# Altium schematic sheet JUMP_PI.schdoc: AT long bus (13.3 x 4.2 inches)
size A; Organization: Organization; Address1: Address1; Address2: Address2; Address3: Address3; Address4: Address4; DocumentNumber: 1; Revision: 0; SheetNumber: 2; SheetTotal: 2
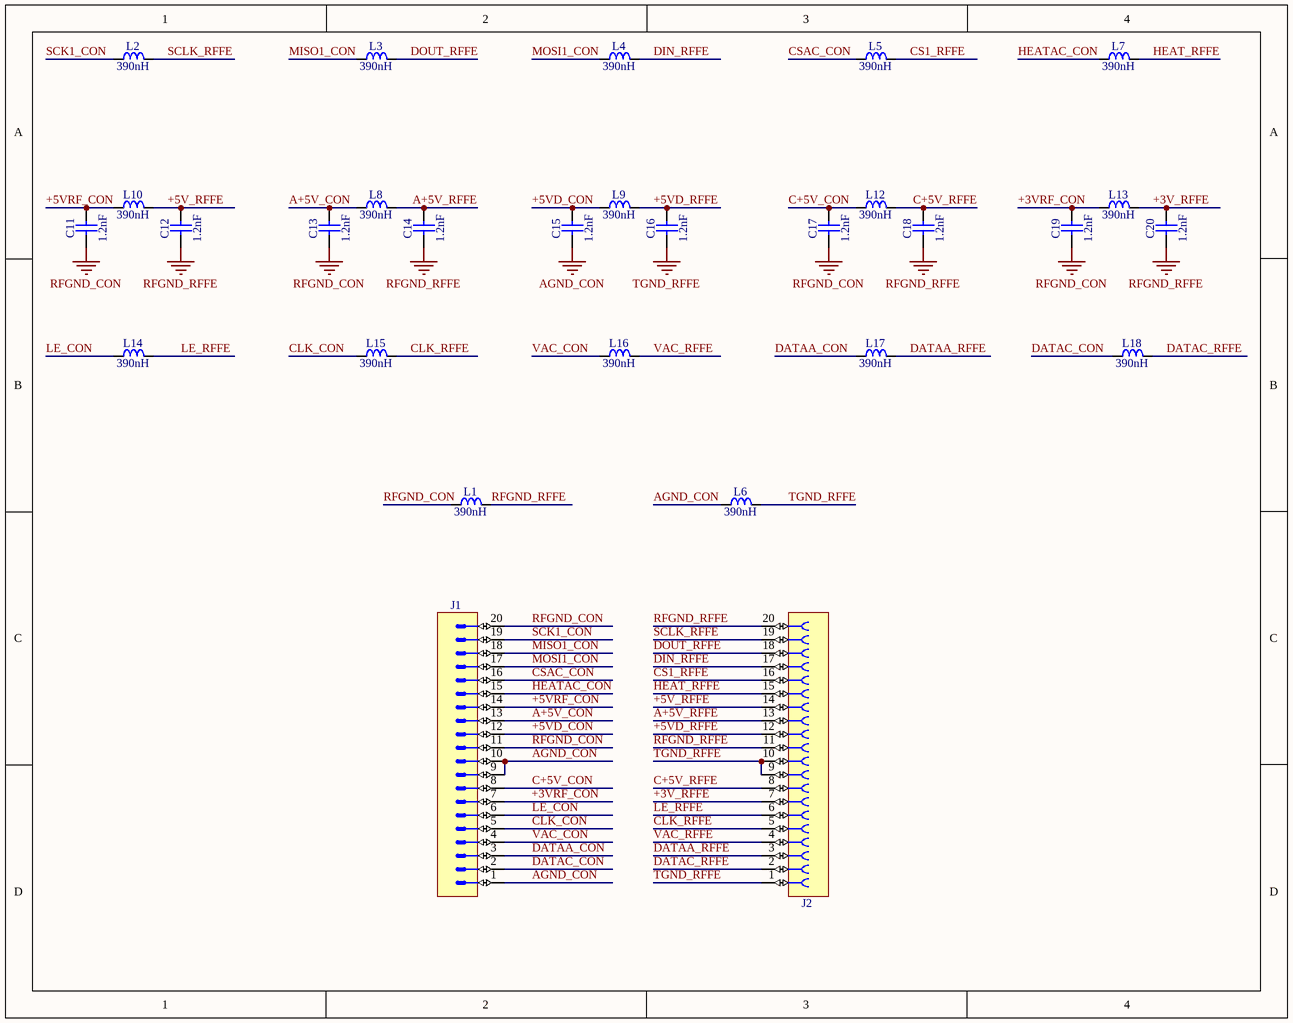
[diagram p0: JUMP_PI.schdoc]

## Parts
C11  1.2nF  [CAPC2012X135N]
C12  1.2nF  [CAPC2012X135N]
C13  1.2nF  [CAPC2012X135N]
C14  1.2nF  [CAPC2012X135N]
C15  1.2nF  [CAPC2012X135N]
C16  1.2nF  [CAPC2012X135N]
C17  1.2nF  [CAPC2012X135N]
C18  1.2nF  [CAPC2012X135N]
C19  1.2nF  [CAPC2012X135N]
C20  1.2nF  [CAPC2012X135N]
J1  Header 20  [SAMTEC_TFM-120-01-L-S-RA]  (value not drawn)
J2  Header 20  [SAMTEC_SFM-120-02-S-SH]  (value not drawn)
L1  390nH  [IND_ABRACON_AISC-0603]
L2  390nH  [IND_ABRACON_AISC-0603]
L3  390nH  [IND_ABRACON_AISC-0603]
L4  390nH  [IND_ABRACON_AISC-0603]
L5  390nH  [IND_ABRACON_AISC-0603]
L6  390nH  [IND_ABRACON_AISC-0603]
L7  390nH  [IND_ABRACON_AISC-0603]
L8  390nH  [IND_ABRACON_AISC-0603]
L9  390nH  [IND_ABRACON_AISC-0603]
L10  390nH  [IND_ABRACON_AISC-0603]
L12  390nH  [IND_ABRACON_AISC-0603]
L13  390nH  [IND_ABRACON_AISC-0603]
L14  390nH  [IND_ABRACON_AISC-0603]
L15  390nH  [IND_ABRACON_AISC-0603]
L16  390nH  [IND_ABRACON_AISC-0603]
L17  390nH  [IND_ABRACON_AISC-0603]
L18  390nH  [IND_ABRACON_AISC-0603]

## Nets
AGND_CON: C15.1 J1.1 J1.9 J1.10 L6.1
RFGND_CON: C11.1 C13.1 C17.1 C19.1 J1.11 J1.20 L1.1
RFGND_RFFE: C12.1 C14.1 C18.1 C20.1 J2.11 J2.20 L1.2
TGND_RFFE: C16.1 J2.1 J2.9 J2.10 L6.2
+3V_RFFE: C20.2 J2.7 L13.2
+3VRF_CON: C19.2 J1.7 L13.1
+5V_RFFE: C12.2 J2.14 L10.2
+5VD_CON: C15.2 J1.12 L9.1
+5VD_RFFE: C16.2 J2.12 L9.2
+5VRF_CON: C11.2 J1.14 L10.1
A+5V_CON: C13.2 J1.13 L8.1
A+5V_RFFE: C14.2 J2.13 L8.2
C+5V_CON: C17.2 J1.8 L12.1
C+5V_RFFE: C18.2 J2.8 L12.2
CLK_CON: J1.5 L15.1
CLK_RFFE: J2.5 L15.2
CS1_RFFE: J2.16 L5.2
CSAC_CON: J1.16 L5.1
DATAA_CON: J1.3 L17.1
DATAA_RFFE: J2.3 L17.2
DATAC_CON: J1.2 L18.1
DATAC_RFFE: J2.2 L18.2
DIN_RFFE: J2.17 L4.2
DOUT_RFFE: J2.18 L3.2
HEAT_RFFE: J2.15 L7.2
HEATAC_CON: J1.15 L7.1
LE_CON: J1.6 L14.1
LE_RFFE: J2.6 L14.2
MISO1_CON: J1.18 L3.1
MOSI1_CON: J1.17 L4.1
SCK1_CON: J1.19 L2.1
SCLK_RFFE: J2.19 L2.2
VAC_CON: J1.4 L16.1
VAC_RFFE: J2.4 L16.2

## Library data of the parts
C11-C20 = CC0805_1.2NF_50V_10%_X7R: Non-polarised capacitor; Part Description: SMD Multilayer Chip Ceramic Capacitor; Manufacturer: GENERIC; Manufacturer1 Part Number: 223858615624; Voltage: 50V; TC: X7R; Tolerance: ±10%; Part Number: CC0805_1.2NF_50V_10%_X7R; Component Kind: Standard; Component Type: Standard; Pin Count: 2; Value: 1.2nF; Status: Preferred; Manufacturer Part Number: CC0805_1.2NF_50V_10%_X7R; Case: 0805; Mounted: Yes; Socket: No; SMD: Yes; Sense: No; Manufacturer1 Example: PHYCOMP; Manufacturer1 ComponentHeight: 1.35mm; HelpURL: \\cern.ch\dfs\Applications\Altium\Datasheets\CC0805_X7R_PHYCOMP.pdf; Author: CERN DEM JLC; CreateDate: 03/12/2007; LatestRevisionDate: 03/12/2007
J1 = SAMTEC_TFM-120-01-L-S-RA: Connector 20 Male; Manufacturer: SAMTEC; Part Description: 20 Contacts - Pitch 1.27mm - Single Row Right Angle Header; PressFit: No; Manufacturer Part Number: TFM-120-01-L-S-RA; Part Number: SAMTEC_TFM-120-01-L-S-RA; Component Kind: Standard; Component Type: Standard; Pin Count: 20; Family: Header 20; Mounted: Yes; Socket: No; Sense: No; SMD: No; Status: None; ComponentHeight: 4.45mm; HelpURL: http://suddendocs.samtec.com/catalog_english/tfm.pdf; Author: LNLS DIG FCS; CreateDate: 30/06/2016; LatestRevisionDate: 30/06/2016
J2 = SAMTEC_SFM-120-02-S-SH: Connector 20 Female; Part Description: 20 Contacts - Pitch 1.27mm - Single Row Right Angle Header; Manufacturer: SAMTEC; PressFit: No; Part Number: SAMTEC_SFM-120-02-S-SH; Component Kind: Standard; Component Type: Standard; Pin Count: 20; Family: Header 20; Mounted: Yes; Socket: No; Sense: No; SMD: Yes; Status: None; Manufacturer Part Number: SFM-120-02-S-SH; ComponentHeight: 2.41mm; HelpURL: http://suddendocs.samtec.com/catalog_english/sfm.pdf; Author: LNLS DIG FCS; CreateDate: 06/07/2016; LatestRevisionDate: 06/07/2016
L1-L10 L12-L18 = IND_390NH_5%_ABRACON_AISC-0603: Inductor; Part Description: SMD Ceramic Wire-Wound Chip Inductor; Manufacturer Part Number: AISC-0603-R39-J; Power: 120mA; Resistance: 2.9R; Tolerance: ±5%; Part Number: IND_390NH_5%_ABRACON_AISC-0603; Component Kind: Standard; Component Type: Standard; Pin Count: 2; Value: 390nH; Status: None; Manufacturer: ABRACON; Case: 0603; Mounted: Yes; Socket: No; SMD: Yes; Sense: No; ComponentHeight: 1.02mm; HelpURL: \\cern.ch\dfs\Applications\Altium\Datasheets\IND_ABRACON_AISC-0603.pdf; Author: CERN DEM JLC; CreateDate: 23/09/2010; LatestRevisionDate: 23/09/2010